# Altium schematic sheet MakeUofT2023 Schematic.SchDoc
size A4; SPICEModelCacheBDXBXEUB: <root> / <DocumentId>BDXBXEUB</DocumentId> / <CacheFrame Number="0"> / <Model Name="cap" Kind="MDL"> / <Text>*Default semiconductor capacitor / .MODEL CAP C()</Text> / </Model> / </CacheFrame> / </root>
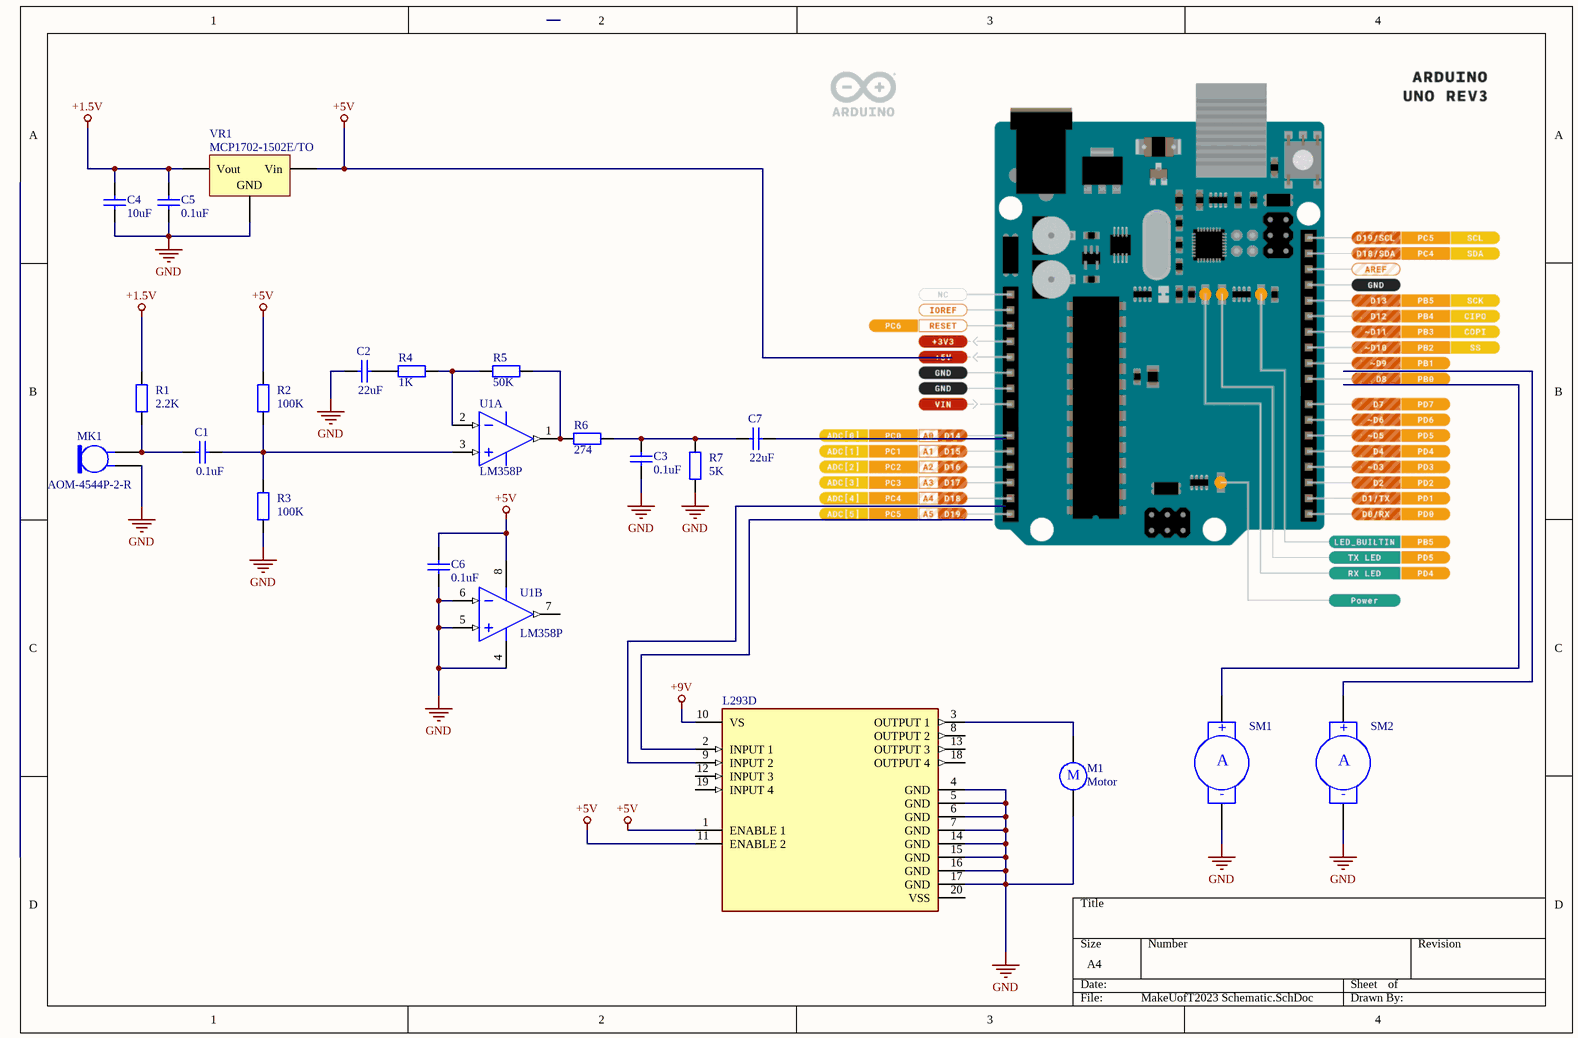
[diagram p0: MakeUofT2023 Schematic.SchDoc]

## Parts
C1  value 0.1uF  [RAD-0.3]  (hidden comment: Cap)
C2  value 22uF  [RAD-0.3]  (hidden comment: Cap)
C3  0.1uF  [RAD-0.3]
C4  10uF  [RAD-0.3]
C5  0.1uF  [RAD-0.3]
C6  0.1uF  [RAD-0.3]
C7  value 22uF  [RAD-0.3]  (hidden comment: Cap)
M1  Motor  [RB5-10.5]
MK1  AOM-4544P-2-R  [PIN2]
R1  2.2K  [AXIAL-0.4]
R2  100K  [AXIAL-0.4]
R3  100K  [AXIAL-0.4]
R4  1K  [AXIAL-0.4]
R5  50K  [AXIAL-0.4]
R6  274  [AXIAL-0.4]
R7  5K  [AXIAL-0.4]
SM1  (no value)  [RAD-0.4]
SM2  (no value)  [RAD-0.4]
U1  LM358P  [P0008A]  (parts A,B of 2)
U?  L293D  [FP-SO20-IPC_C]
VR1  MCP1702-1502E/TO  [D2PAK_N]

## Nets
+1.5V: C4.2 C5.2 R1.2 VR1.1(Vout)
+5V: C6.1 R2.2 U1.8(VCC) U?.1(ENABLE_1) U?.11(ENABLE_2) VR1.3(Vin)
+9V: U?.10(VS)
GND: C2.1 C3.1 C4.1 C5.1 C6.2 M1.2 MK1.1 R3.1 R7.1 SM1.2(-) SM2.2(-) U1.4(GND) U1.5(2IN+) U1.6(2IN-) U?.4(GND) U?.5(GND) U?.6(GND) U?.7(GND) U?.14(GND) U?.15(GND) U?.16(GND) U?.17(GND) VR1.2(GND)
NetC1_1: C1.1 MK1.2 R1.1
NetC1_2: C1.2 R2.1 R3.2 U1.3(1IN+)
NetC2_2: C2.2 R4.1
NetC3_2: C3.2 C7.1 R6.2 R7.2
NetM1_1: M1.1 U?.3(OUTPUT_1)
NetR4_2: R4.2 R5.1 U1.2(1IN-)
NetR5_2: R5.2 R6.1 U1.1(1OUT)

Not connected (* = marked no-connect by the designer): C7 2; SM1 1(+); SM2 1(+); U1 7(2OUT); U? 2(INPUT_1) 8(OUTPUT_2) 9(INPUT_2) 12(INPUT_3) 13(OUTPUT_3) 18(OUTPUT_4) 19(INPUT_4) 20(VSS)

## Notes on the sheet
- (in symbol Motor) M
- (in symbol Motor Servo) A

## Library data of the parts
C1 C2 C4 C5 C7 = Cap: Capacitor; Published: 8-Jun-2000; LatestRevisionDate: 17-Jul-2002; LatestRevisionNote: Re-released for DXP Platform.; PackageReference: RAD-0.3; Publisher: Altium Limited; PackageDescription: Radial Cap, Thru-Hole; 2 Leads; 0.3 in Pin Spacing
C3 C6 = Cap: Capacitor; Value: 100pF; Published: 8-Jun-2000; LatestRevisionDate: 17-Jul-2002; LatestRevisionNote: Re-released for DXP Platform.; PackageReference: RAD-0.3; Publisher: Altium Limited; PackageDescription: Radial Cap, Thru-Hole; 2 Leads; 0.3 in Pin Spacing
M1 = Motor: Motor, General Kind; Published: 24-Mar-1999; LatestRevisionDate: 17-Jul-2002; LatestRevisionNote: Re-released for DXP Platform.; PackageReference: RB5-10.5; Publisher: Altium Limited; PackageDescription: Capacitor (Radial); 2 Leads
MK1 = Mic2: Microphone; Published: 24-Mar-1999; LatestRevisionDate: 17-Jul-2002; LatestRevisionNote: Re-released for DXP Platform.; PackageReference: PIN2; Publisher: Altium Limited
R1 R2 R7 = Res2: Resistor; Value: 1K; Published: 8-Jun-2000; LatestRevisionDate: 17-Jul-2002; LatestRevisionNote: Re-released for DXP Platform.; PackageReference: AXIAL-0.4; Publisher: Altium Limited; PackageDescription: Axial Device, Thru-Hole; 2 Leads; 0.4 in Pin Spacing
R3-R6 = Res2: Resistor; Published: 8-Jun-2000; LatestRevisionDate: 17-Jul-2002; LatestRevisionNote: Re-released for DXP Platform.; PackageReference: AXIAL-0.4; Publisher: Altium Limited; PackageDescription: Axial Device, Thru-Hole; 2 Leads; 0.4 in Pin Spacing
  R3: Value: 100K
SM1 SM2 = Motor Servo: Servo Motor; Published: 24-Mar-1999; LatestRevisionDate: 17-Jul-2002; LatestRevisionNote: Re-released for DXP Platform.; PackageReference: RAD-0.4; Publisher: Altium Limited; PackageDescription: Radial Cap, Thru-Hole; 2 Leads; 0.4 in Pin Spacing
U1 = CMP-2000-06549-1: Dual Operational Amplifier, 3 to 32 V, 0 to 70 degC, 8-Pin PDIP (P), RoHS, Tape and Reel; Manufacturer: Technik Industrial; Datasheet Version: Rev. T, 04/2015; Datasheet URL: http://www.ti.com/lit/ds/symlink/lm358.pdf; Manufacturer URL: http://www.technik.com.hk/; Package Description: 8-Pin Double In-line Package, Body 9.59 x 6.35 mm, Pitch 2.54 mm; Mounting Technology: ThroughHole; Package URL: http://www.ti.com/lit/ml/mpdi001b/mpdi001b.pdf; Package Reference: P8
U? = CMP-12151-000006-1: IC MTR DRV BIPOLR 4.5-36V 20SOIC; Operating Supply Voltage: 24V; Min Supply Voltage: 4.5V; Motor Type: Brushed; Interface: Parallel; Max Supply Voltage: 36V; Logic Function: AND; Max Collector Current: 600mA; Switching Frequency: 5kHz; Number of Channels: 4; Radiation Hardening: No; Mount: Surface Mount; Min Operating Temperature: -40°C; Height: 2.65mm; Lead Free: Lead Free; Case/Package: SO; Packaging: Tape and Reel; Max Operating Temperature: 150°C; Collector Emitter Voltage (VCEO): 36V; Width: 7.6mm; Package Quantity: 1000; Output Current: 600mA; Number of Pins: 20; Length: 13mm
VR1 = Volt Reg: Voltage Regulator; Published: 24-Mar-1999; LatestRevisionDate: 29-May-2009; LatestRevisionNote: IPC-7351 Footprint Added.; PackageReference: D2PAK; Publisher: Altium Limited; PackageDescription: 3-Pin Transistor Outline Package 2.54 mm Pitch, 15.1 mm Lead Span